# Altium project LM833_Normal.PrjPcb
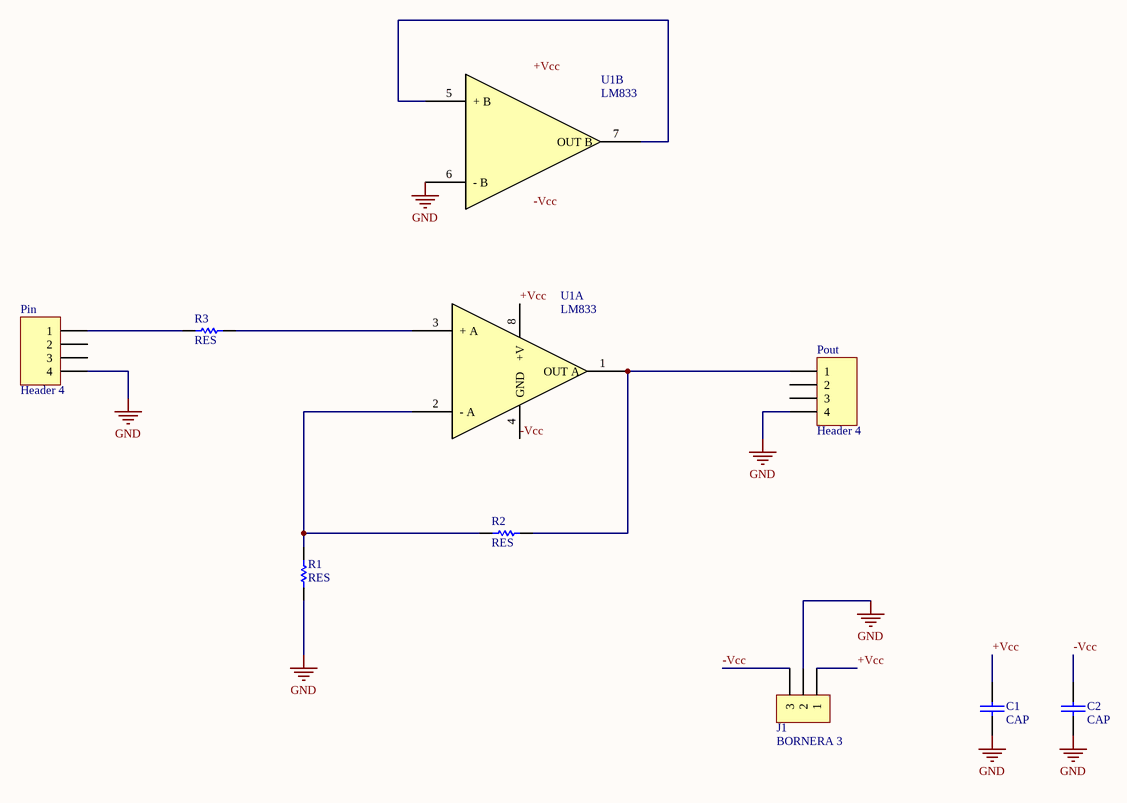
[diagram p0: Sheet1.SchDoc]
1 sheet, 9 parts. Net scope: global (net labels, ports and power ports of the same name join across sheets).
Board file: PCB1.PcbDoc

## Sheet Sheet1.SchDoc
size A4

### Parts
C1  CAP  [0805]
C2  CAP  [0805]
J1  BORNERA 3  [BORNERA3]
Pin  Header 4  [HDR1X4]
Pout  Header 4  [HDR1X4]
R1  RES  [0805]
R2  RES  [0805]
R3  RES  [0805]
U1  LM833  [DIP8]  (parts A,B of 2)

### Nets
GND: C1.2 C2.1 J1.2 Pin.4 Pout.4 R1.1 U1.6(-_B)
+Vcc: C1.1 J1.1 U1.8(+V)
-Vcc: C2.2 J1.3 U1.4(GND)
NetPin_1: Pin.1 R3.1
NetPout_1: Pout.1 R2.2 U1.1(OUT_A)
NetR1_2: R1.2 R2.1 U1.2(-_A)
NetR3_2: R3.2 U1.3(+_A)
NetU1_5: U1.5(+_B) U1.7(OUT_B)

Not connected (* = marked no-connect by the designer): Pin 2 3; Pout 2 3

### Notes on the sheet
- Labels drawn without touching a wire or pin: +Vcc, -Vcc

### Library data of the parts
Pin Pout = Header 4: Header, 4-Pin; LatestRevisionDate: 17-Jul-2002; LatestRevisionNote: Re-released for DXP Platform.; Publisher: Altium Limited
U1 = LM833: Dual Audio Operational Amplifier